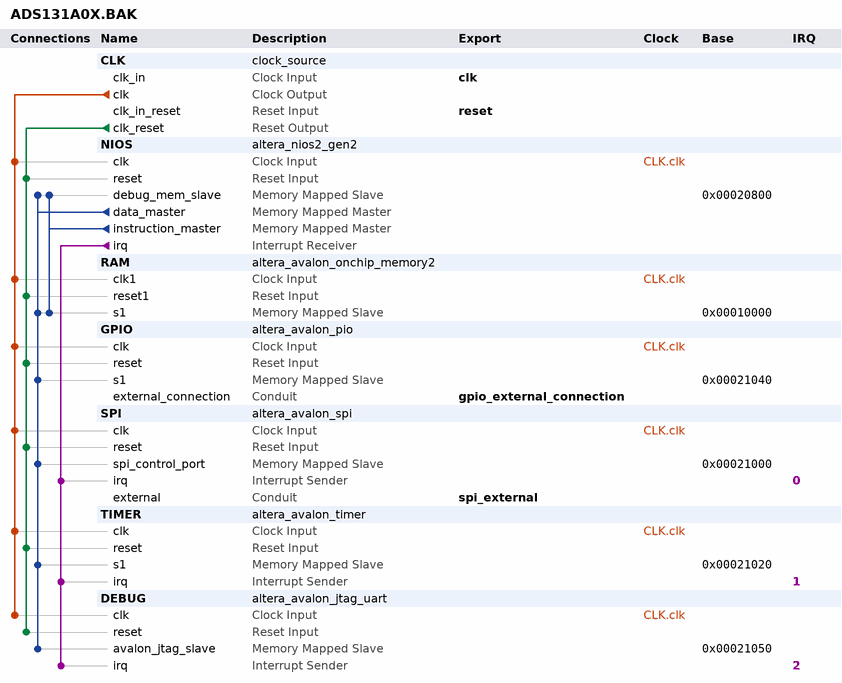
[diagram p0: system contents]
# Platform Designer (Qsys) system ADS131A0X.BAK, Cyclone 10 LP 10CL025YU256I7G
# Parameters at their usual value, and those the tool derives, are not listed.
package require -exact qsys 18.1
create_system ADS131A0X.BAK
set_project_property DEVICE_FAMILY {Cyclone 10 LP}
set_project_property DEVICE 10CL025YU256I7G

add_instance CLK clock_source 18.1
set_instance_parameter_value CLK clockFrequency 50000000

add_instance NIOS altera_nios2_gen2 18.1
set_instance_parameter_value NIOS dcache_size 2048
set_instance_parameter_value NIOS exceptionSlave RAM.s1
set_instance_parameter_value NIOS icache_size 4096
set_instance_parameter_value NIOS impl Tiny
set_instance_parameter_value NIOS resetSlave RAM.s1

add_instance RAM altera_avalon_onchip_memory2 18.1
set_instance_parameter_value RAM dataWidth 32
set_instance_parameter_value RAM dualPort false
set_instance_parameter_value RAM initMemContent true
set_instance_parameter_value RAM initializationFileName onchip_mem.hex
set_instance_parameter_value RAM memorySize 40960

add_instance GPIO altera_avalon_pio 18.1
set_instance_parameter_value GPIO direction Output
set_instance_parameter_value GPIO width 2

add_instance SPI altera_avalon_spi 18.1
set_instance_parameter_value SPI clockPhase 1
set_instance_parameter_value SPI clockPolarity 0
set_instance_parameter_value SPI dataWidth 8
set_instance_parameter_value SPI masterSPI true
set_instance_parameter_value SPI numberOfSlaves 1
set_instance_parameter_value SPI targetClockRate 128000

add_instance TIMER altera_avalon_timer 18.1
set_instance_parameter_value TIMER period 0.5
set_instance_parameter_value TIMER periodUnits SEC

add_instance DEBUG altera_avalon_jtag_uart 18.1
set_instance_parameter_value DEBUG simInteractiveOptions NO_INTERACTIVE_WINDOWS

# connections
add_connection CLK.clk DEBUG.clk clock
add_connection CLK.clk GPIO.clk clock
add_connection CLK.clk NIOS.clk clock
add_connection CLK.clk RAM.clk1 clock
add_connection CLK.clk SPI.clk clock
add_connection CLK.clk TIMER.clk clock
add_connection CLK.clk_reset DEBUG.reset reset
add_connection CLK.clk_reset GPIO.reset reset
add_connection CLK.clk_reset NIOS.reset reset
add_connection CLK.clk_reset RAM.reset1 reset
add_connection CLK.clk_reset SPI.reset reset
add_connection CLK.clk_reset TIMER.reset reset
add_connection NIOS.data_master DEBUG.avalon_jtag_slave avalon
set_connection_parameter_value NIOS.data_master/DEBUG.avalon_jtag_slave baseAddress 0x00021050
add_connection NIOS.data_master GPIO.s1 avalon
set_connection_parameter_value NIOS.data_master/GPIO.s1 baseAddress 0x00021040
add_connection NIOS.data_master NIOS.debug_mem_slave avalon
set_connection_parameter_value NIOS.data_master/NIOS.debug_mem_slave baseAddress 0x00020800
add_connection NIOS.data_master RAM.s1 avalon
set_connection_parameter_value NIOS.data_master/RAM.s1 baseAddress 0x00010000
add_connection NIOS.data_master SPI.spi_control_port avalon
set_connection_parameter_value NIOS.data_master/SPI.spi_control_port baseAddress 0x00021000
add_connection NIOS.data_master TIMER.s1 avalon
set_connection_parameter_value NIOS.data_master/TIMER.s1 baseAddress 0x00021020
add_connection NIOS.instruction_master NIOS.debug_mem_slave avalon
set_connection_parameter_value NIOS.instruction_master/NIOS.debug_mem_slave baseAddress 0x00020800
add_connection NIOS.instruction_master RAM.s1 avalon
set_connection_parameter_value NIOS.instruction_master/RAM.s1 baseAddress 0x00010000
add_connection NIOS.irq DEBUG.irq interrupt
set_connection_parameter_value NIOS.irq/DEBUG.irq irqNumber 2
add_connection NIOS.irq SPI.irq interrupt
set_connection_parameter_value NIOS.irq/SPI.irq irqNumber 0
add_connection NIOS.irq TIMER.irq interrupt
set_connection_parameter_value NIOS.irq/TIMER.irq irqNumber 1

# exported interfaces
add_interface clk clock sink
set_interface_property clk EXPORT_OF CLK.clk_in
add_interface gpio_external_connection conduit end
set_interface_property gpio_external_connection EXPORT_OF GPIO.external_connection
add_interface reset reset sink
set_interface_property reset EXPORT_OF CLK.clk_in_reset
add_interface spi_external conduit end
set_interface_property spi_external EXPORT_OF SPI.external

set_interconnect_requirement {$system} qsys_mm.clockCrossingAdapter HANDSHAKE
set_interconnect_requirement {$system} qsys_mm.enableEccProtection FALSE
set_interconnect_requirement {$system} qsys_mm.insertDefaultSlave FALSE
set_interconnect_requirement {$system} qsys_mm.maxAdditionalLatency 1

save_system ADS131A0X.BAK.qsys
